# EAGLE design untitled (EAGLE 9.3.0)
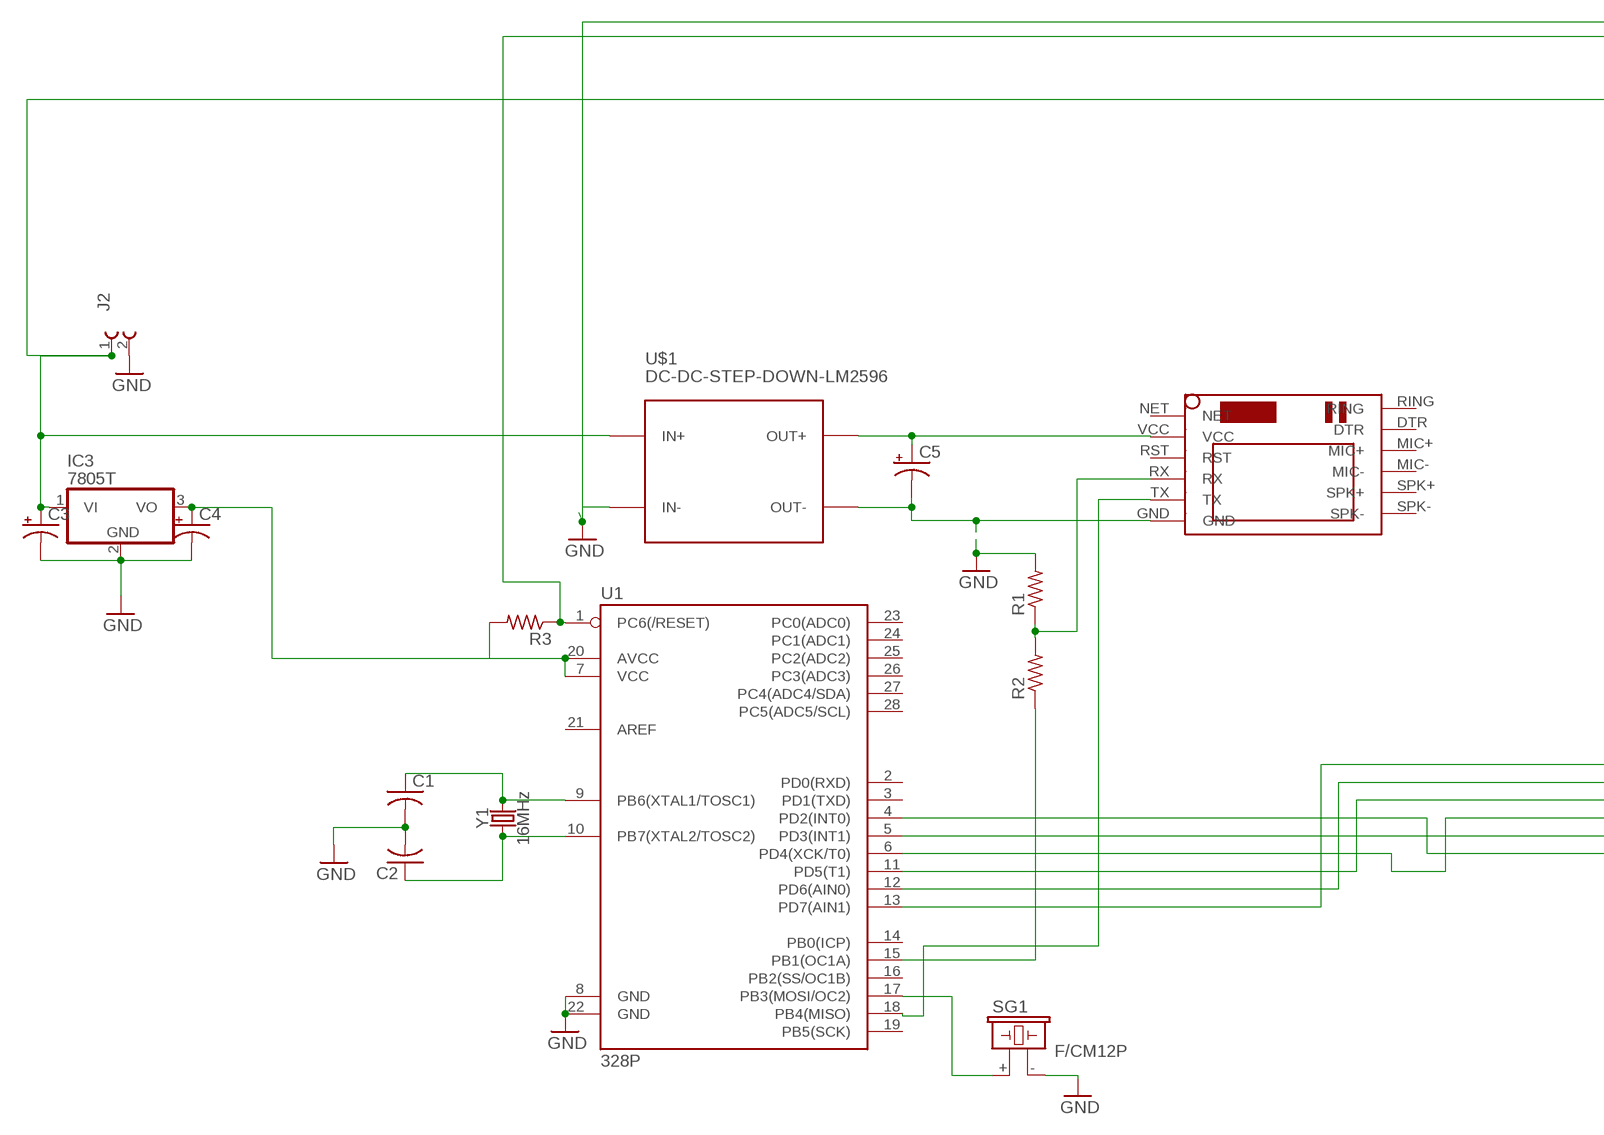
[diagram p0: schematic, sheet 1, part 1 of 2]
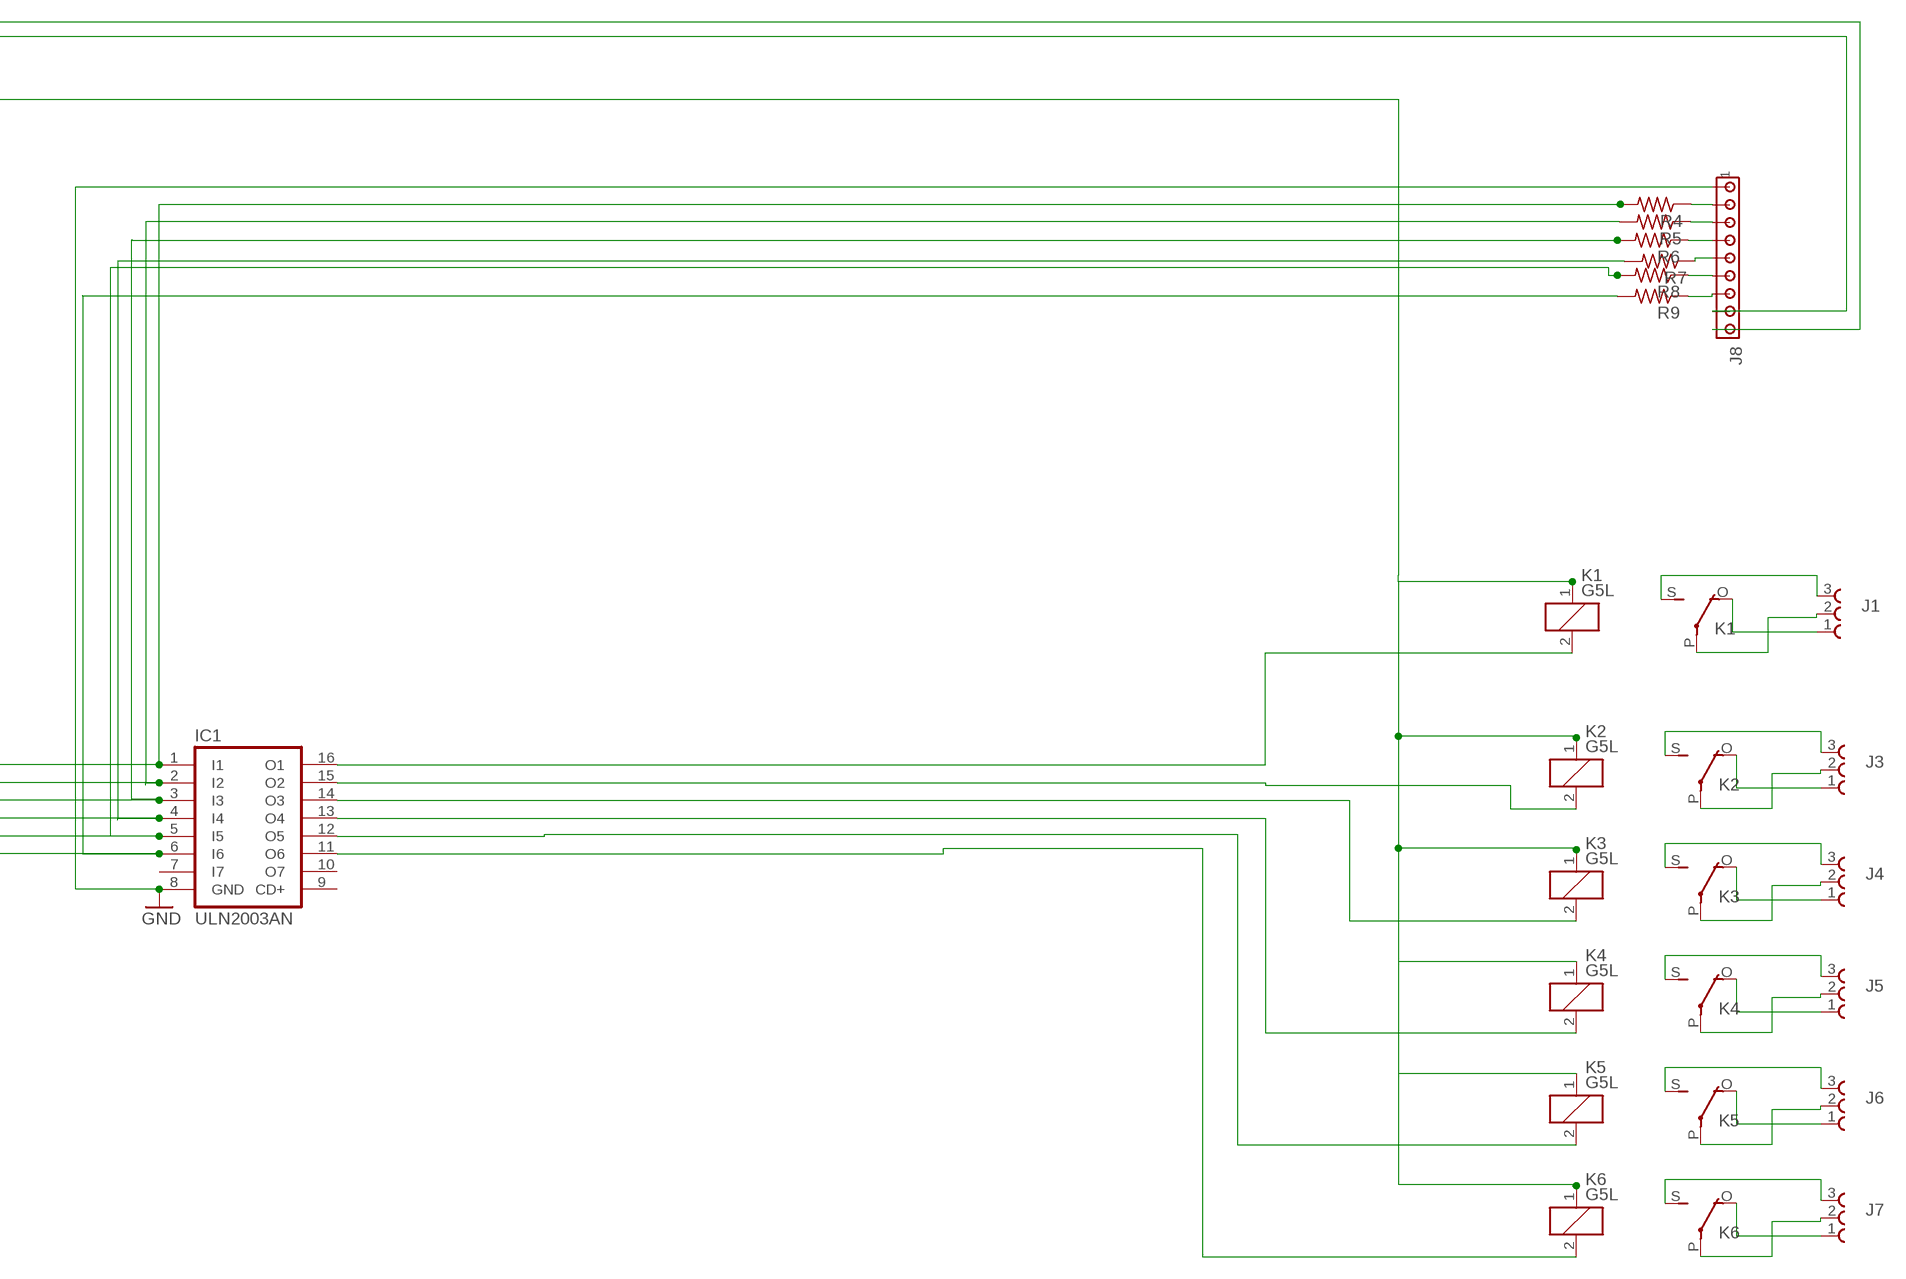
[diagram p1: schematic, sheet 1, part 2 of 2]

## Parts
C1  C-US025-024X044  [C025-024X044]
C2  C-US025-024X044  [C025-024X044]
C3  CPOL-USE2.5-5  [E2,5-5]
C4  CPOL-USE2.5-5  [E2,5-5]
C5  CAPACITOR-PE5-8.5  [E5-8,5]
IC1  ULN2003AN  [DIL16]
IC3  7805T  [TO220H]
J1  691216700003  [691216700003]
J2  691217910002  [691217910002]
J3  691216700003  [691216700003]
J4  691216700003  [691216700003]
J5  691216700003  [691216700003]
J6  691216700003  [691216700003]
J7  691216700003  [691216700003]
J8  MTA09-100  [10X09MTA]
K1  G5L  [G5LE]
K2  G5L  [G5LE]
K3  G5L  [G5LE]
K4  G5L  [G5LE]
K5  G5L  [G5LE]
K6  G5L  [G5LE]
R1  R-US_0204/7  [0204/7]
R2  R-US_0204/7  [0204/7]
R3  R-US_0204/7  [0204/7]
R4  R-US_0204/7  [0204/7]
R5  R-US_0204/7  [0204/7]
R6  R-US_0204/7  [0204/7]
R7  R-US_0204/7  [0204/7]
R8  R-US_0204/7  [0204/7]
R9  R-US_0204/7  [0204/7]
SG1  F/CM12P  [F/CM12P]
U1  328P  ATMEGA328P_PDIP  [DIP28]
U$1  DC-DC-STEP-DOWN-LM2596  [DC-DC-STEP-DOWN-LM2596]
U$2  SIM800LMODULE  [SIM800LMODULE]
Y1  16MHz  CRYSTAL-16MHZPTH-HC49US  [HC49US]

## Nets
GND: C1.2 C2.2 C3.- C4.- C5.- IC1.8(GND) IC3.2(GND) J2.2 J8.1 J8.9 R1.2 SG1.- U1.8(GND) U1.22(GND) U$1.IN- U$1.OUT- U$2.GND
N$1: IC1.1(I1) R4.2 U1.13(PD7(AIN1))
N$2: C2.1 U1.10(PB7(XTAL2/TOSC2)) Y1.1
N$3: C1.1 U1.9(PB6(XTAL1/TOSC1)) Y1.2
N$4: IC1.2(I2) R5.2 U1.12(PD6(AIN0))
N$5: IC1.3(I3) R6.2 U1.11(PD5(T1))
N$6: IC1.4(I4) R7.2 U1.6(PD4(XCK/T0))
N$7: IC1.5(I5) R8.2 U1.5(PD3(INT1))
N$8: IC1.6(I6) R9.2 U1.4(PD2(INT0))
N$10: IC1.16(O1) K1.2
N$11: C4.+ IC3.3(VO) R3.2 U1.7(VCC) U1.20(AVCC)
N$12: J8.2 R4.1
N$13: IC1.15(O2) K2.2
N$14: IC1.14(O3) K3.2
N$15: C5.+ U$1.OUT+ U$2.VCC
N$16: U1.18(PB4(MISO)) U$2.TX
N$17: R2.1 U1.15(PB1(OC1A))
N$18: R1.1 R2.2 U$2.RX
N$19: IC1.13(O4) K4.2
N$20: J1.2 K1.P(2:P)
N$21: J1.3 K1.S(2:S)
N$22: J1.1 K1.O(2:O)
N$23: J8.3 R5.1
N$24: IC1.12(O5) K5.2
N$25: J3.2 K2.P(2:P)
N$26: J3.3 K2.S(2:S)
N$27: J3.1 K2.O(2:O)
N$28: J8.8 R3.1 U1.1(PC6(/RESET))
N$29: J4.2 K3.P(2:P)
N$30: J4.3 K3.S(2:S)
N$31: J4.1 K3.O(2:O)
N$32: SG1.+ U1.17(PB3(MOSI/OC2))
N$33: J5.2 K4.P(2:P)
N$34: J5.3 K4.S(2:S)
N$35: J5.1 K4.O(2:O)
N$36: J8.4 R6.1
N$37: J6.2 K5.P(2:P)
N$38: J6.3 K5.S(2:S)
N$39: J6.1 K5.O(2:O)
N$40: IC1.11(O6) K6.2
N$41: J7.2 K6.P(2:P)
N$42: J7.3 K6.S(2:S)
N$43: J7.1 K6.O(2:O)
N$45: J8.5 R7.1
N$46: J8.6 R8.1
N$47: J8.7 R9.1
N$55: C3.+ IC3.1(VI) J2.1 K1.1 K2.1 K3.1 K4.1 K5.1 K6.1 U$1.IN+
Unconnected: IC1.7(I7) IC1.9(CD+) IC1.10(O7) U1.2(PD0(RXD)) U1.3(PD1(TXD)) U1.14(PB0(ICP)) U1.16(PB2(SS/OC1B)) U1.19(PB5(SCK)) U1.21(AREF) U1.23(PC0(ADC0)) U1.24(PC1(ADC1)) U1.25(PC2(ADC2)) U1.26(PC3(ADC3)) U1.27(PC4(ADC4/SDA)) U1.28(PC5(ADC5/SCL)) U$2.DTR U$2.MIC+ U$2.MIC- U$2.NET U$2.RING U$2.RST U$2.SPK+ U$2.SPK-

## Library data of the parts
C1 C2 = adafruit:C-US: CAPACITOR, American symbol
C3 C4 = adafruit:CPOL-US: POLARIZED CAPACITOR, American symbol
C5 = BeagleBone_Blue_R3:CAPACITOR-P: POLARIZED CAPACITOR, American symbol
IC1 = uln-udn:ULN2003A: DRIVER ARRAY
IC3 = adafruit:78*: Positive VOLTAGE REGULATOR Added bigger pads to the TO-92 package
J1 J3-J7 = Wurth_Elektronik_Electromechanic_Terminal_Blocks_Connectors_rev19b:691216700003: SERIE 2167 - 5.00 MM - VERTICAL CABLE ENTRY WITH RISING CAGE CLAMP - WR-TBL =>ConTBL2 691216700003 Characteristics INSULATOR:PA6/66 FLAMABILITY RATING: UL94V0 COLOR: GREEN METAL HOUSING: COPPER ALLOY / Ni+Sn TERMINAL SCREW: STEEL / Zn WIRE GUARD: COPPER ALLOY / Ni+Sn OPERATING TEMPERATURE:-30°C UP TO +120°C COMPLIANCE: LEAD FREE AND ROHS ELECTRICAL UL VDE CURRENT RATING: 14A 24A WORKING VOLTAGE: 300VAC 250VAC WITHSTANDING VOLTAGE: 1,6KV 2KV CONTACT RESISTANCE: 20 mOhm max <http://katalog.we-online.de/media/images/v2/Family_WR-TBL_5_00_2167_VERTICAL_CABLE_ENTRY_W_RISING_CLAMP_6912167000XX.jpg> Details see: http://katalog.we-online.de/en/em/TBL_5_00_2167_VERTICAL_CABLE_ENTRY_W_RISING_CLAMP_6912167000XX 2015 (C) Wurth Elektronik
J2 = Wurth_Elektronik_Electromechanic_Terminal_Blocks_Connectors_rev19b:691217910002: WR-TBL Terminal block - serie 2179 - 2 Pins;=>Code : Con_TBL_Screw_RisingClamp_7.50_6912179100xx_691217910002 Created 11/27/2014, Karrer Zheng 2014 (C) Wurth Elektronik
J8 = con-amp:MTA09-100: AMP connector
K1-K6 = relay:G5L: RELAY 1 x switch, 10 A/120 V AC, 8 A/30 V ADC, Omron; OC_FARNELL: unknown; OC_NEWARK: unknown
R1-R9 = adafruit:R-US_: RESISTOR, American symbol
SG1 = buzzer:F/CM12P: BUZZER Source: Buerklin; OC_FARNELL: unknown; OC_NEWARK: unknown
U1 = SparkFun-IC-Microcontroller:ATMEGA328P_PDIP: Atmel 328P Through hole ATMEGA328P uC used in the Arduino 32kb flash, 1k EEPROM, 2k SRAM Datasheet <http://www.sparkfun.com/datasheets/Components/SMD/ATMega328.pdf> SparkFun Products Storefront component: AVR 28 Pin 20MHz 32K 6A/D - ATMega328P <https://www.sparkfun.com/products/9061> (COM-09061) SparkFun Simon Says - Through-Hole Soldering Kit <https://www.sparkfun.com/products/10547> (KIT-10547) SparkFun Learn to Solder - Simon Says <https://www.sparkfun.com/products/13708> (KIT-13708) SparkFun BigTime Watch Kit <https://www.sparkfun.com/products/11734> (KIT-11734) SparkFun ClockIt <https://www.sparkfun.com/products/10930> (KIT-10930) SparkFun Serial Enabled LCD Kit <https://www.sparkfun.com/products/10097> (LCD-10097) SparkFun Simon Tilts - Through Hole Soldering Kit <https://www.sparkfun.com/products/12634> (KIT-12634) SparkFun Frequency Counter Kit <https://www.sparkfun.com/products/10140> (KIT-10140) FabFM Radio Kit <https://www.sparkfun.com/products/11043> (KIT-11043) SparkFun Binary Blaster Kit <https://www.sparkfun.com/products/12037> (KIT-12037) SparkFun Metro-Gnome <https://www.sparkfun.com/products/9236> (KIT-09236) ATmega328 with Arduino Optiboot (Uno) <https://www.sparkfun.com/products/10524> (DEV-10524); PROD_ID: IC-09136
U$1 = diy-modules:DC-DC-STEP-DOWN-LM2596: DC/DC Step-Down Regulator based on LM2596-ADJ chip LM2596 datasheet available here: http://www.ti.com/lit/ds/symlink/lm2596.pdf Click here to find device on ebay.com <http://www.ebay.com/sch/lm2596+power+regulator>
U$2 = SIM800LMODULE:SIM800LMODULE: SIM800L Module
Y1 = SparkFun-Clocks:CRYSTAL-16MHZ: 16MHz Crystal Digikey Example <http://www.digikey.com/product-search/en?keywords=535-9122-1-ND> Frequency: 16MHz Frequency Stability: ±50ppm Frequency Tolerance: ±20ppm Load Capacitance: 18pF SparkFun Products: Pro Micro -5V/16MHz <https://www.sparkfun.com/products/12640> SparkFun Serial Enabled LCD Kit <https://www.sparkfun.com/products/10097>; PROD_ID: XTAL-08181; SF_ID: COM-00536

## Board
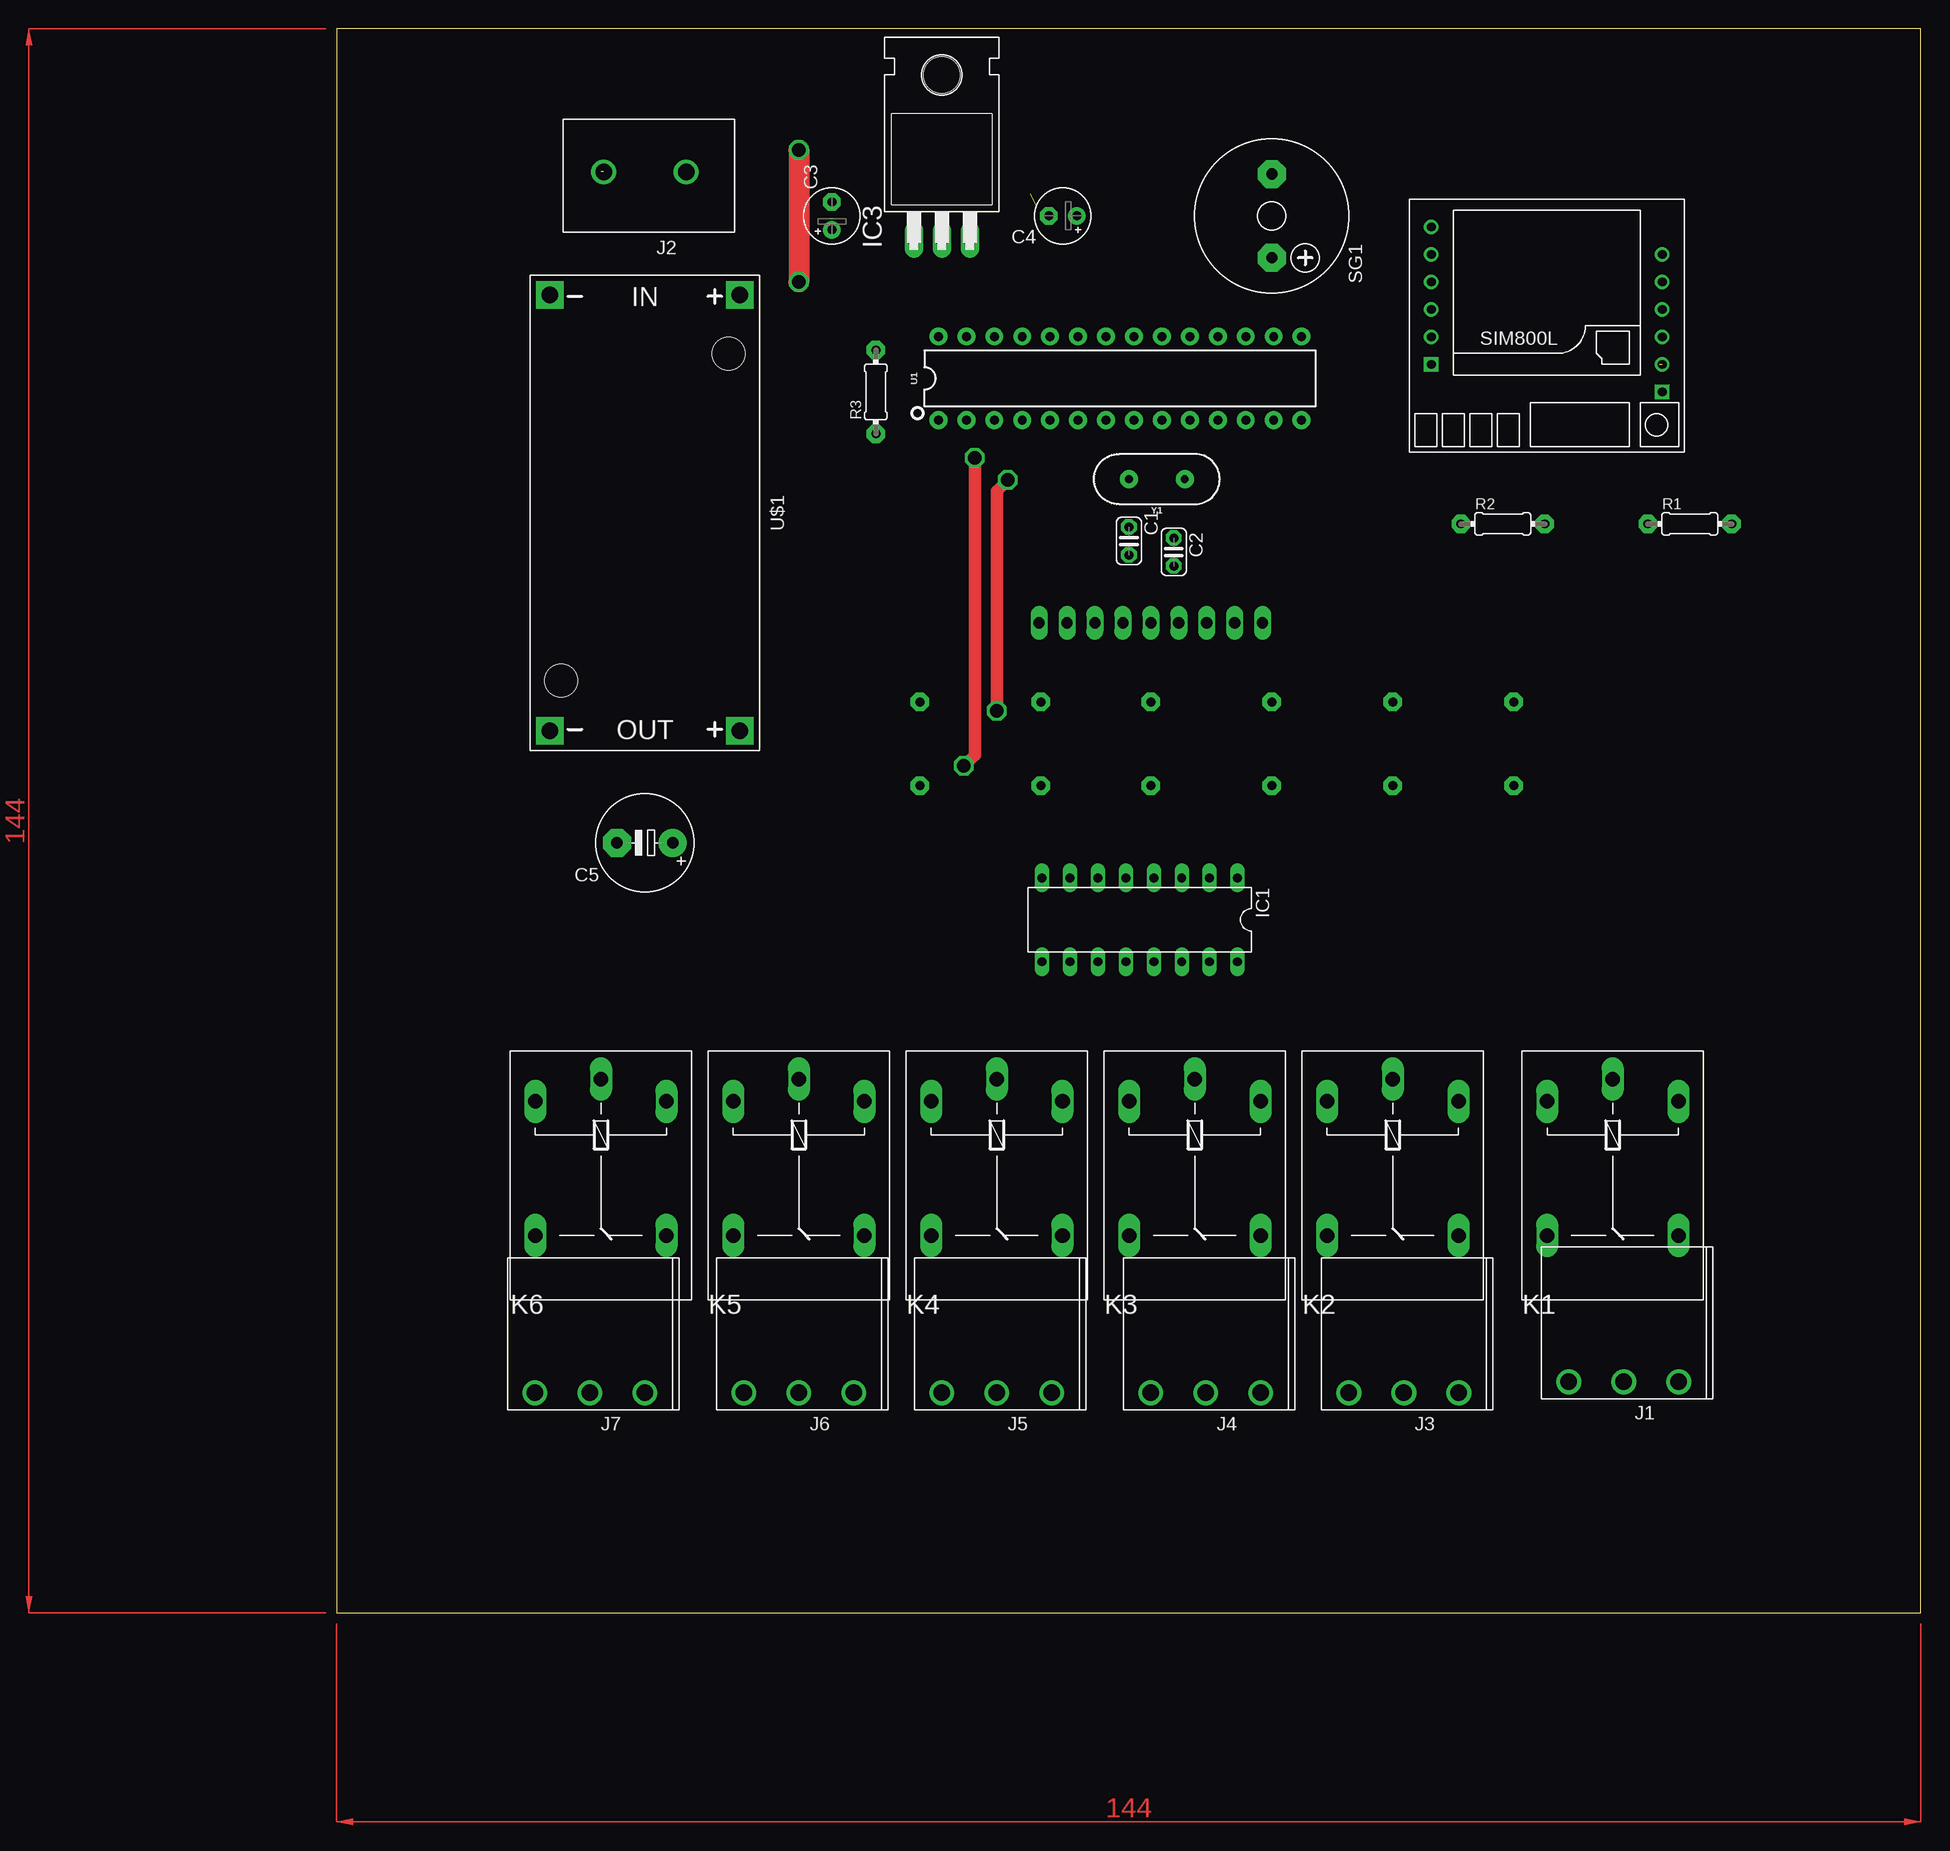
[diagram p2: board, top side]
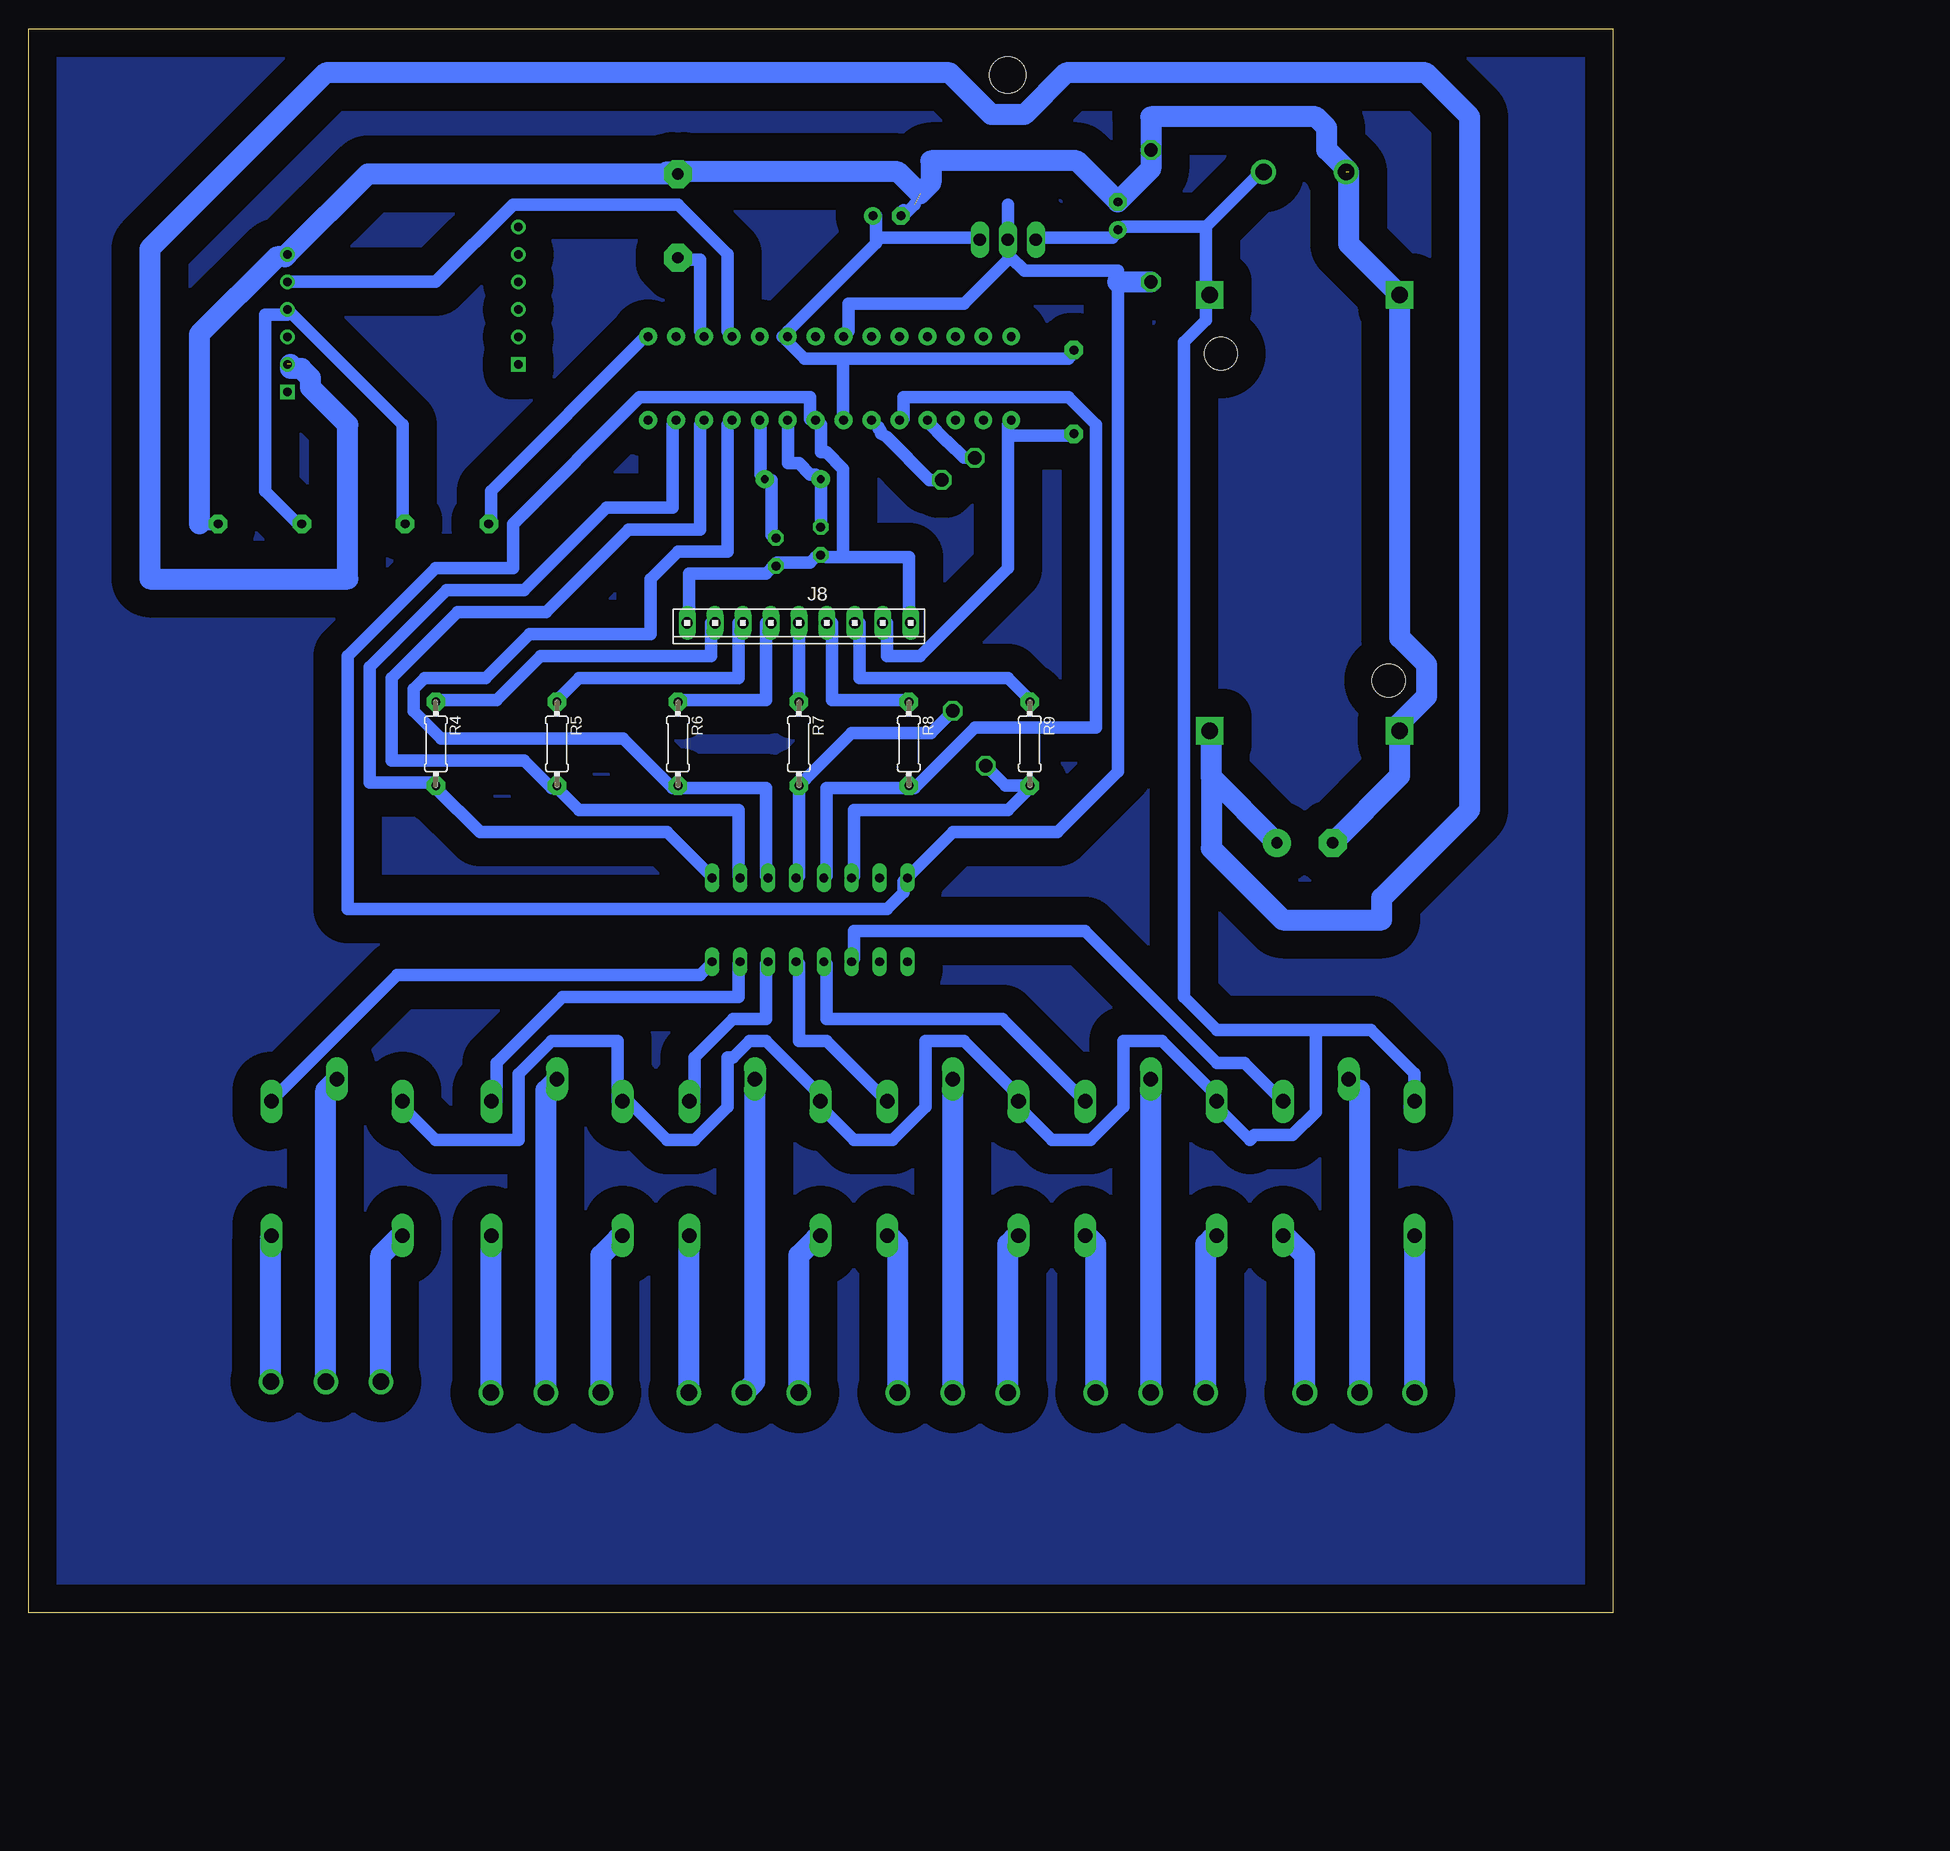
[diagram p3: board, bottom side, seen from below]

Size 144 x 144 mm. Coordinates in mm from the lower left corner, seen from the top.
Outline: 0,0 144,0 144,144 0,144 0,0
Copper layers (1*16): Top 0.035mm / dielectric 1.5mm / Bottom 0.035mm
Design rules "default *": minimum track width 75mil, minimum drill 0.35mm, track to track 30mil, track to pad 20mil, pad to pad 6mil, via to via 6mil, smd to smd 6mil, copper to edge 40mil, drill to drill 6mil, minimum pad ring 10mil, minimum via ring 8mil, stop-mask expansion 4mil, vias tented up to drill 0mil, thermal gap 10mil

### Footprints (pad centres in the part's own frame; a part is rotated, then mirrored left to right if it is on the bottom)
C025-024X044 = drill 0.813 pad 1.422 octagon: 1 -1.27,0; 2 1.27,0
E2,5-5 = drill 0.813 pad 1.6: + -1.27,0 | drill 0.813 pad 1.6 octagon: - 1.27,0
E5-8,5 = drill 1.016 pad 2.54: + -2.54,0 | drill 1.016 pad 2.54 octagon: - 2.54,0
DIL16 = drill 0.813 long: 1 -8.89,-3.81; 2 -6.35,-3.81; 3 -3.81,-3.81; 4 -1.27,-3.81; 5 1.27,-3.81; 6 3.81,-3.81; 7 6.35,-3.81; 8 8.89,-3.81; 9 8.89,3.81; 10 6.35,3.81; 11 3.81,3.81; 12 1.27,3.81; 13 -1.27,3.81; 14 -3.81,3.81; 15 -6.35,3.81; 16 -8.89,3.81
TO220H = drill 1.118 long: 1 -2.54,-10.16; 2 0,-10.16; 3 2.54,-10.16 | hole 3.302: 0,4.826
691216700003 = drill 1.5: 1 -5,0; 2 0,0; 3 5,0
691217910002 = drill 1.5: 1 -3.75,0; 2 3.75,0
10X09MTA = drill 1.016 long: 1 10.16,0; 2 7.62,0; 3 5.08,0; 4 2.54,0; 5 0,0; 6 -2.54,0; 7 -5.08,0; 8 -7.62,0; 9 -10.16,0
G5LE = drill 1.321 long: 1 -7.493,-5.969; 2 -7.493,5.969; O 4.699,5.969; P -9.525,0; S 4.699,-5.969
0204/7 = drill 0.813 pad 1.676 octagon: 1 -3.81,0; 2 3.81,0
F/CM12P = drill 1.016 pad 2.54 octagon: + 3.81,0; - -3.81,0
DIP28 = drill 0.813 pad 1.626: 1 -16.51,-3.81; 2 -13.97,-3.81; 3 -11.43,-3.81; 4 -8.89,-3.81; 5 -6.35,-3.81; 6 -3.81,-3.81; 7 -1.27,-3.81; 8 1.27,-3.81; 9 3.81,-3.81; 10 6.35,-3.81; 11 8.89,-3.81; 12 11.43,-3.81; 13 13.97,-3.81; 14 16.51,-3.81; 15 16.51,3.81; 16 13.97,3.81; 17 11.43,3.81; 18 8.89,3.81; 19 6.35,3.81; 20 3.81,3.81; 21 1.27,3.81; 22 -1.27,3.81; 23 -3.81,3.81; 24 -6.35,3.81; 25 -8.89,3.81; 26 -11.43,3.81; 27 -13.97,3.81; 28 -16.51,3.81
DC-DC-STEP-DOWN-LM2596 = drill 1.5 pad 2.5 square: IN+ -19.812,8.636; IN- -19.812,-8.636; OUT+ 19.812,8.636; OUT- 19.812,-8.636 | hole 3: -14.478,7.62; 15.24,-7.62
SIM800LMODULE = drill 0.8: DTR 10.5,1; GND -10.5,-6.5; MIC+ 10.5,-1.5; MIC- 10.5,-4; RST -10.5,1; RX -10.5,-1.5; SPK+ 10.5,-6.5; SPK- 10.5,-9; TX -10.5,-4; VCC -10.5,3.5 | drill 0.8 square: NET -10.5,6; RING 10.5,3.5
HC49US = drill 0.7 pad 1.651: 1 -2.54,0; 2 2.54,0

### Placement (x,y rotation side)
C1  72.01,97.45 270 top
C2  76.09,96.45 270 top
C3  45,127 90 top
C4  66,127 180 top
C5  28,70 180 top
IC1  73,63 180 top
IC3  55,135 0 top
J1  117,21 180 top
J2  28,131 180 top
J3  97,20 180 top
J4  79,20 180 top
J5  60,20 180 top
J6  42,20 180 top
J7  23,20 180 top
J8  74,90 180 bottom
K1  116,39 270 top
K2  96,39 270 top
K3  78,39 270 top
K4  60,39 270 top
K5  42,39 270 top
K6  24,39 270 top
R1  123,99 0 top
R2  106,99 0 top
R3  49,111 90 top
R4  107,79 270 bottom
R5  96,79 270 bottom
R6  85,79 270 bottom
R7  74,79 270 bottom
R8  64,79 270 bottom
R9  53,79 270 bottom
SG1  85,127 270 top
U1  71.2,112.23 0 top
U$1  28,100 270 top
U$2  110,117 180 top
Y1  74.55,103.07 180 top

### Tracks (layer width: path | path; a pad name or v marks a point on that pad's centre or on a via)
GND  (via drill 1.2 pad 0.3)  (3 unrouted)
  Top 1.905: v42,133 v42,121
  Bottom 1.143: 70,96 71.5,96 C1.2 72.5,96 73,95.5 76,95.5 C2.2 76.5,95 77,94.5 84,94.5 84,90 J8.1 | 70,96 64,96 64,90 J8.9 | 70,96 70,104 71.5,105.5 72,105.5 72,108 U1.8 73,108.5 73,110.5 88.5,110.5 100,99 100,95 107,95 115,87 115,64 66,64 64.5,65.5 64.5,66.5 IC1.8 64,67 60,71 50.5,71 45,76.5 45,121 45,122 53.5,122 54.75,123.25 | 54.75,123.25 55,123.5 IC3.2 55,128 | 54.75,123.25 59,119 69.5,119 69.5,116.5 U1.22 | 128.5,99 R1.2 | 63.5,128 64.5,127 C4.- 64.5,127.5
  Bottom 1.905: C5.- 19.36,76.1 U$1.OUT- 19.36,80.87 16.91,83.32 16.91,86.2 19.36,88.65 U$1.IN- 24,124.45 24,131 26,133 26,135 27,136 42,136 v42,133 42,131.27 44.87,128.4 45.02,128.31 45,128.29 48.71,132 62,132 62,130 63,129 65,131 85.19,131 | 86,131 85.19,131 | 85.19,131 SG1.- 113.19,130.81 U$2.GND 120.71,123.29 121.45,123.29 128.5,116.23 128.5,99 | 45,121 v42,121
N$1
  Bottom 1.143: IC1.1 82,67 86,71 103,71 107,75 R4.2 107,75.5 113,75.5 113,86 106,93 99,93 91.5,100.5 85.5,100.5 85.5,108 U1.13
N$2
  Bottom 1.143: C2.1 76.5,98 76.5,103 77,103 Y1.1 77.5,103.5 77.5,108 U1.10
N$3
  Bottom 1.143: C1.1 72,99 72,103 Y1.2 72.5,103.5 73,103.5 74,104.5 75,104.5 75,108 U1.9
N$4
  Bottom 1.143: IC1.2 79.5,67 79.5,73 94,73 96,75 R5.2 96.5,75 99,77.5 111,77.5 111,85 105,91 97,91 89.5,98.5 83,98.5 83,108 U1.12
N$5
  Bottom 1.143: IC1.3 77,67 77,75 85,75 R6.2 85.5,75 90,79.5 106.5,79.5 109,82 109,84 108,85 102.5,85 98.5,89 87.5,89 87.5,94 85,96.5 80.5,96.5 80.5,108 U1.11
N$6  (via drill 1.2 pad 0.3)
  Top 1.143: v60,82 60,102 v61,103
  Bottom 1.143: IC1.4 74,67 R7.2 73.41,75.78 73.41,75.79 69.19,80 62,80 v60,82 | U1.6 66.74,107.77 66.74,107.64 66.59,107.48 66.53,107.23 66,106.89 62.11,103 v61,103
N$7
  Bottom 1.143: IC1.5 71.5,67 71.5,75 64,75 R8.2 63.5,75 58,80.5 47,80.5 47,108 49.5,110.5 64.5,110.5 64.5,108.5 U1.5
N$8  (via drill 1.2 pad 0.3)
  Top 1.143: v58,105 58,78 v57,77
  Bottom 1.143: IC1.6 69,67 69,73 55,73 53,75 R9.2 55.19,75.19 v57,77 | U1.4 62.31,108.28 60.55,106.53 60.53,106.53 59,105 v58,105
N$9
  pour Bottom (isolate 2.54): 0,144 144,144 144,0 0,0
N$10
  Bottom 1.143: IC1.16 82,59 83,58 110.5,58 122,46.5 K1.2
N$11
  Bottom 1.143: 67,125 67,127 C4.+ | 67,125 58,125 IC3.3 | 70,114 70,108.5 U1.7 | 70,114 73.5,114 75.5,116 U1.20 75,116.5 67,124.5 67,125 | 70,114 49.5,114 49,114.5 R3.2
N$12
  Bottom 1.143: J8.2 82,90 82,87 97.5,87 101.5,83 107,83 R4.1
N$13
  Bottom 1.143: IC1.15 79.5,59 79.5,56 95.5,56 101.5,50 101.5,46.5 K2.2
N$14
  Bottom 1.143: IC1.14 77,59 77,54 80,54 83.5,50.5 83.5,46.5 K3.2
N$15  (1 unrouted)
  Bottom 1.143: 30.5,70 C5.+ 30.5,70.5 | 36.5,80 U$1.OUT+
  Bottom 1.905: C5.+ 36.5,75.96 | 36.5,75.96 36.5,80 | 36.5,75.96 36.5,69.5 30,63 21,63 21,65 13,73 13,136 17,140 49.71,140 53.5,136.21 56.5,136.21 60.29,140 117,140 133,124 133,94 115,94 115,108 118.39,111.39 118.39,112.26 119.24,113.11 120.21,113.11 120.21,113.5
N$16
  Bottom 1.143: U$2.TX 107,121 100,128 85,128 80.5,123.5 80.5,116.5 U1.18
N$17
  Bottom 1.143: U1.15 88,116 102,102 102,99 R2.1
N$18
  Bottom 1.143: R2.2 110,99 110,108 U$2.RX 120.5,118 122.5,118 122.5,102 119.5,99 R1.1
N$19
  Bottom 1.143: IC1.13 74,59 74,52 71.5,52 66,46.5 K4.2
N$20
  Bottom 1.905: J1.2 117,47.5 116,48.5 K1.P
N$21
  Bottom 1.905: J1.3 112,32.5 110.5,34 K1.S
N$22
  Bottom 1.905: J1.1 122,34 K1.O
N$23
  Bottom 1.143: J8.3 79.5,90 79.5,85 94,85 96,83 R5.1
N$24
  Bottom 1.143: IC1.12 71.5,59 71.5,54 55.5,54 48,46.5 K5.2
N$25
  Bottom 1.905: J3.2 97,47.5 96,48.5 K2.P
N$26
  Bottom 1.905: J3.3 92,32.5 90.5,34 K2.S
N$27
  Bottom 1.905: J3.1 102,34 K2.O
N$28
  Bottom 1.143: 55,107 55,108 U1.1 | 55,107 55,95 63,87 66,87 66,90 J8.8 | 55,107 49,107 R3.1
N$29
  Bottom 1.905: K3.P 78,21 J4.2
N$30
  Bottom 1.905: J4.3 74,32.5 72.5,34 K3.S
N$31
  Bottom 1.905: J4.1 84,34 K3.O
N$32
  Bottom 1.143: U1.17 83,116.5 83,123 85,123 SG1.+
N$33
  Bottom 1.905: J5.2 K4.P
N$34
  Bottom 1.905: J5.3 55,33.5 54.5,34 K4.S
N$35
  Bottom 1.905: J5.1 65,33.5 65.5,34 K4.O
N$36
  Bottom 1.143: J8.4 77,90 77,83 85,83 R6.1
N$37
  Bottom 1.905: J6.2 K5.P
N$38
  Bottom 1.905: J6.3 37,33.5 36.5,34 K5.S
N$39
  Bottom 1.905: J6.1 47,33.5 47.5,34 K5.O
N$40
  Bottom 1.143: IC1.11 69,59.5 69,62 48,62 36,50 33.5,50 30,46.5 K6.2
N$41
  Bottom 1.143: 23,47.52 K6.P
  Bottom 1.905: J7.2 23,47.52
N$42
  Bottom 1.905: J7.3 18,34 K6.S
N$43
  Bottom 1.905: J7.1 28,32.5 29.5,34 K6.O
N$45
  Bottom 1.143: R7.1 J8.5
N$46
  Bottom 1.143: J8.6 71,90 71,83 64,83 R8.1
N$47
  Bottom 1.143: J8.7 68.5,90 68.5,85 55,85 53,83 R9.1
N$55
  Bottom 1.143: IC3.1 52,125 45.5,125 45,125.5 C3.+ 44.5,126 37,126 | 37,126 32,131 J2.1 | 37,126 37,120 U$1.IN+ 37,119.5 37,117.5 39,115.5 39,56 36,53 27,53 | K1.1 110,46 107,43 99.5,43 99.5,49 96.5,52 90.5,52 90.5,46.5 K2.1 89.5,46.5 86,43 83.5,43 80.5,46 80.5,50.5 80,50.5 78.5,52 77,52 72,47 K3.1 72,46 69,43 65.5,43 62.5,46 62.5,52 59,52 54,47 K4.1 54,46 51,43 47.5,43 44.5,46 44.5,52 41,52 36,47 K5.1 36,46 33,43 32.57,43.43 29.11,43.43 27,45.54 27,53 | 18.5,46 K6.1 18.03,49.03 22,53 27,53
(copper drawn outside any net)
  shapes: Top area x2